# Altium schematic sheet 100_Motor_Mosfet.SchDoc
size A; SheetNumber: 2; SheetTotal: 3
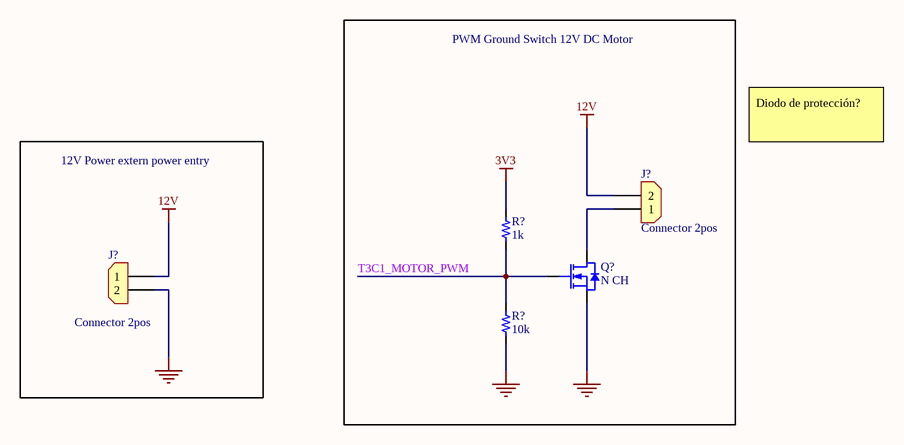
[diagram p0: 100_Motor_Mosfet.SchDoc]

## Parts
(Parts that share a designator on the sheet are numbered #1, #2 ... from top to bottom, then left to right.)
J?#1  Connector 2pos  [CON_2x1_TH_5MM]
J?#2  Connector 2pos  [CON_2x1_TH_5MM]
Q?  N CH  [SOT_23_3]
R?#1  value 1k  [0603_res]  (hidden comment: 1k 1/10W)
R?#2  value 10k  [0603_res]  (hidden comment: 10k 1/10W)

## Blocks framed on the sheet
PWM Ground Switch 12V DC Motor: J?#1 Q? R?#1 R?#2
12V Power extern power entry: J?#2

## Nets
3V3: R?#1.2
12V: J?#1.2 J?#2.1
GND: J?#2.2 Q?.2(S) R?#2.1
T3C1_MOTOR_PWM: Q?.1(G) R?#1.1 R?#2.2
NetJ?#1_1: J?#1.1 Q?.3(D)

## Notes on the sheet
- Diodo de protección?

## Library data of the parts
J?#1 J?#2 = Con_2x1_TH_5mm: 2POS 5MM; Manufacturer: JILN; Manufacturer Part Number: JL126-50002G01; Supplier 1: LCSC; Supplier Part Number 1: C394556; ComponentLink1Description: Digi-Key; ComponentLink1URL: https://www.lcsc.com/product-detail/Screw-terminal_JILN-JL126-50002G01_C394556.html
Q? = Q_NFET_20V_3.2A_SOT23: MOSFET N-CH 20V SOT23; Manufacturer: Doeshare; Manufacturer Part Number: DN2302S; Supplier 1: LCSC; Supplier Part Number 1: C2931750; ComponentLink1Description: LCSC; ComponentLink1URL: https://www.lcsc.com/product-detail/MOSFETs_Doeshare-DN2302S_C2931750.html
R?#1 = Res_1k_0603_1/10W: RES SMD 1k OHM 5% 1/10W 0603; Manufacturer: FOJAN; Manufacturer Part Number: FRC0603J102 TS; ComponentLink1URL: https://www.lcsc.com/product-detail/Chip-Resistor-Surface-Mount_FOJAN-FRC0603J102-TS_C2907113.html; Supplier 1: LCSC; Supplier Part Number 1: C2907113; ComponentLink1Description: LCSC
R?#2 = Res_10k_0603_1/10W: RES SMD 10k OHM 5% 1/10W 0603; Manufacturer: FOJAN; Manufacturer Part Number: FRC0603J103TS; ComponentLink1URL: https://www.lcsc.com/product-detail/Chip-Resistor-Surface-Mount_FOJAN-FRC0603J103TS_C2930027.html; Supplier 1: LCSC; Supplier Part Number 1: C2930027; ComponentLink1Description: LCSC